# Altium project Alimentation.PrjPcb
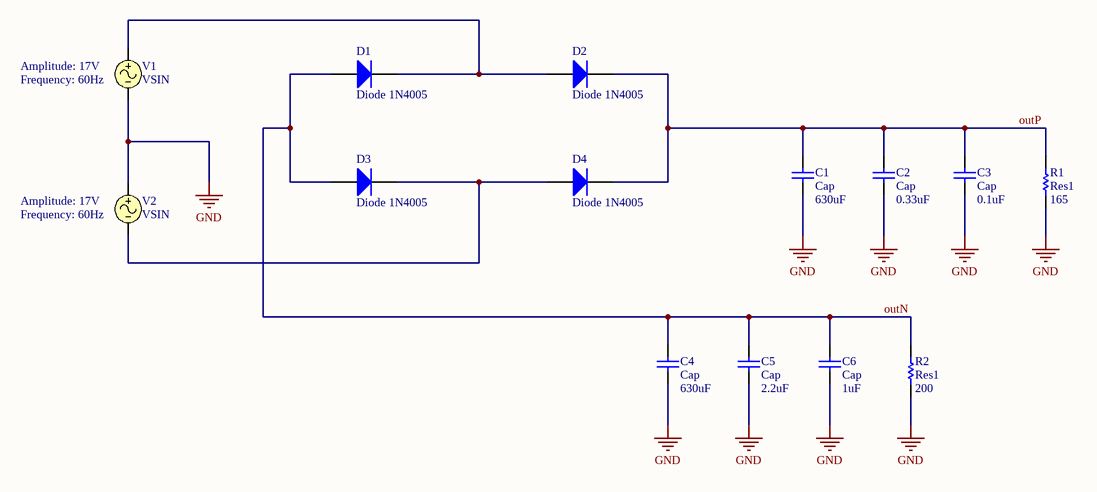
[diagram p0: Alimentation.SchDoc]
1 sheet, 14 parts. Net scope: global (net labels, ports and power ports of the same name join across sheets).

## Sheet Alimentation.SchDoc
size A4

### Parts
C1  Cap  value 630uF  [RAD-0.3]
C2  Cap  value 0.33uF  [RAD-0.3]
C3  Cap  value 0.1uF  [RAD-0.3]
C4  Cap  value 630uF  [RAD-0.3]
C5  Cap  value 2.2uF  [RAD-0.3]
C6  Cap  value 1uF  [RAD-0.3]
D1  Diode 1N4005  [DO-41]
D2  Diode 1N4005  [DO-41]
D3  Diode 1N4005  [DO-41]
D4  Diode 1N4005  [DO-41]
R1  Res1  value 165  [AXIAL-0.3]
R2  Res1  value 200  [AXIAL-0.3]
V1  VSIN  Amplitude: 17V  Frequency: 60Hz
V2  VSIN  Amplitude: 17V  Frequency: 60Hz

### Nets
GND: C1.1 C2.1 C3.1 C4.1 C5.1 C6.1 R1.1 R2.1 V1.2 V2.1
outN: C4.2 C5.2 C6.2 D1.1(A) D3.1(A) R2.2
outP: C1.2 C2.2 C3.2 D2.2(K) D4.2(K) R1.2
NetD1_2: D1.2(K) D2.1(A) V1.1
NetD3_2: D3.2(K) D4.1(A) V2.2

### Library data of the parts
C1-C6 = Cap: Capacitor; Published: 8-Jun-2000; LatestRevisionDate: 17-Jul-2002; LatestRevisionNote: Re-released for DXP Platform.; PackageReference: RAD-0.3; Publisher: Altium Limited; PackageDescription: Radial Cap, Thru-Hole; 2 Leads; 0.3 in Pin Spacing
D1-D4 = Diode 1N4005: 1 Amp General Purpose Rectifier; Published: 8-Jun-2000; LatestRevisionDate: 17-Jul-2002; LatestRevisionNote: Re-released for DXP Platform.; DatasheetVersion: 1998; PackageVersion: Aug-1999; PackageReference: DO-41; Publisher: Altium Limited; PackageDescription: Diode, Axial; Body 5.2 x 2.7 mm (LxDia. max), Lead Dia. 0.86 mm (max); Code_JEDEC: DO-204-AL; ComponentLink1Description: Manufacturer Link; ComponentLink1URL: http://www.fairchildsemi.com/; ComponentLink2Description: Datasheet; ComponentLink2URL: http://www.fairchildsemi.com/ds/1N%2F1N4001.pdf
R1 R2 = Res1: Resistor; Published: 8-Jun-2000; LatestRevisionDate: 17-Jul-2002; LatestRevisionNote: Re-released for DXP Platform.; PackageReference: AXIAL-0.3; Publisher: Altium Limited; PackageDescription: Axial Device, Thru-Hole; 2 Leads; 0.3 in Pin Spacing
V1 V2 = VSIN: Sinusoidal Voltage Source; Note: PCB Footprint - Not required; Published: 8-Jun-2000; LatestRevisionDate: 15-Nov-2004; LatestRevisionNote: Corrected Netlist.; PackageReference: Not Applicable; Publisher: Altium Limited